# EAGLE schematic ferminator2000 (EAGLE 6.2)

## Sheet 1 of 4
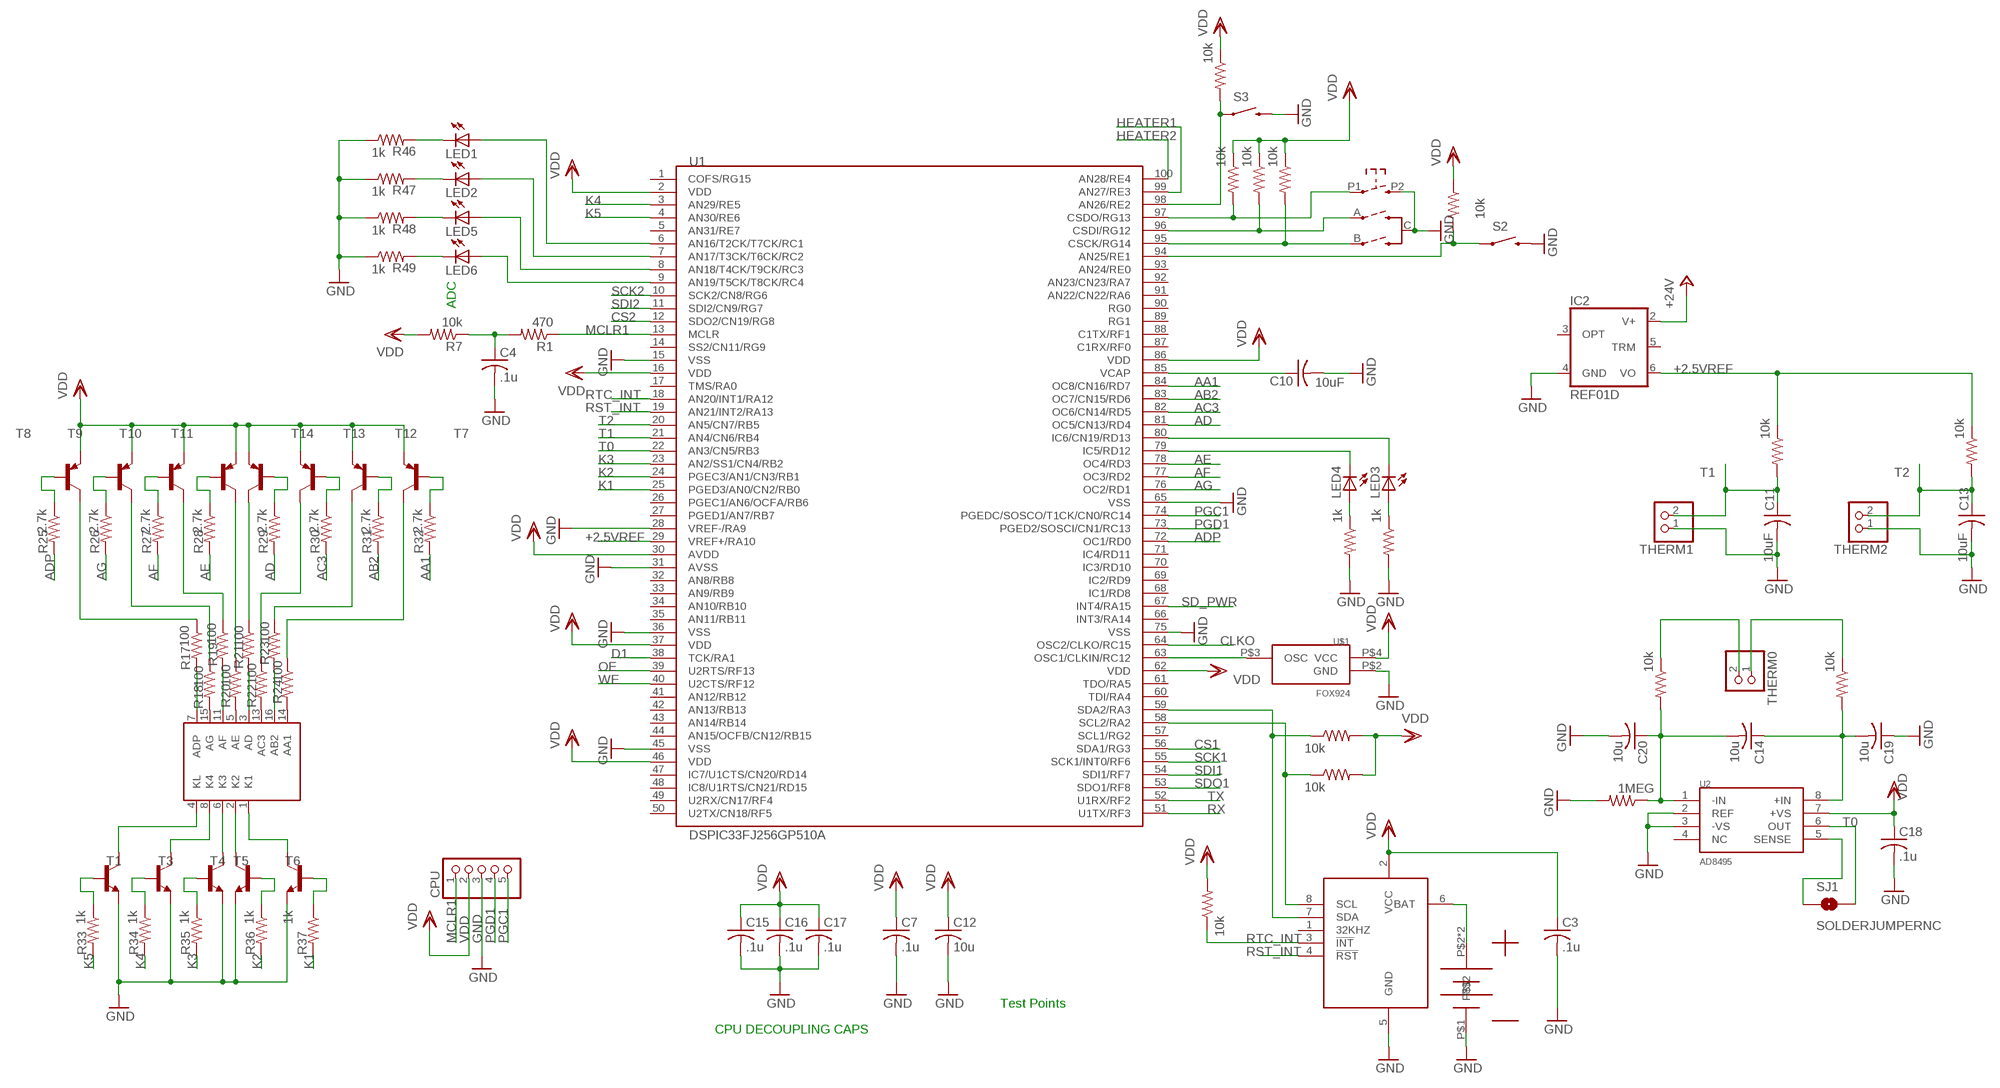
[diagram p0: schematic, sheet 1]

### Parts
C3  .1u  C-USC0603  [C0603]
C4  .1u  C-USC0603  [C0603]
C7  .1u  C-USC0603  [C0603]
C10  10uF  C-USC0805  [C0805]
C11  10uF  C-USC0805  [C0805]
C12  10u  C-USC0805  [C0805]
C13  10uF  C-USC0805  [C0805]
C14  10u  C-USC0603  [C0603]
C15  .1u  C-USC0603  [C0603]
C16  .1u  C-USC0603  [C0603]
C17  .1u  C-USC0603  [C0603]
C18  .1u  C-USC0603  [C0603]
C19  10u  C-USC0603  [C0603]
C20  10u  C-USC0603  [C0603]
CPU  PINHD-1X5  [1X05]
IC2  REF01D  [SO08]
LED1  LEDCHIP-LED0805  [CHIP-LED0805]
LED2  LEDCHIP-LED0805  [CHIP-LED0805]
LED3  LEDCHIP-LED0805  [CHIP-LED0805]
LED4  LEDCHIP-LED0805  [CHIP-LED0805]
LED5  LEDCHIP-LED0805  [CHIP-LED0805]
LED6  LEDCHIP-LED0805  [CHIP-LED0805]
R1  470  R-US_R0805  [R0805]
R7  10k  R-US_R0805  [R0805]
R14  1k  R-US_R0805  [R0805]
R15  1k  R-US_R0805  [R0805]
R17  100  R-US_R0805  [R0805]
R18  100  R-US_R0805  [R0805]
R19  100  R-US_R0805  [R0805]
R20  100  R-US_R0805  [R0805]
R21  100  R-US_R0805  [R0805]
R22  100  R-US_R0805  [R0805]
R23  100  R-US_R0805  [R0805]
R24  100  R-US_R0805  [R0805]
R25  2.7k  R-US_R0805  [R0805]
R26  2.7k  R-US_R0805  [R0805]
R27  2.7k  R-US_R0805  [R0805]
R28  2.7k  R-US_R0805  [R0805]
R29  2.7k  R-US_R0805  [R0805]
R30  2.7k  R-US_R0805  [R0805]
R31  2.7k  R-US_R0805  [R0805]
R32  2.7k  R-US_R0805  [R0805]
R33  1k  R-US_R0805  [R0805]
R34  1k  R-US_R0805  [R0805]
R35  1k  R-US_R0805  [R0805]
R36  1k  R-US_R0805  [R0805]
R37  1k  R-US_R0805  [R0805]
R38  10k  R-US_R0805  [R0805]
R39  10k  R-US_R0805  [R0805]
R40  1MEG  R-US_R0805  [R0805]
R41  10k  R-US_R0805  [R0805]
R42  10k  R-US_R0805  [R0805]
R43  10k  R-US_R0805  [R0805]
R44  10k  R-US_R0805  [R0805]
R45  10k  R-US_R0805  [R0805]
R46  1k  R-US_R0805  [R0805]
R47  1k  R-US_R0805  [R0805]
R48  1k  R-US_R0805  [R0805]
R49  1k  R-US_R0805  [R0805]
R50  10k  R-US_R0805  [R0805]
R51  10k  R-US_R0805  [R0805]
R52  10k  R-US_R0805  [R0805]
R53  10k  R-US_R0805  [R0805]
R54  10k  R-US_R0805  [R0805]
S2  SWITCH-MOMENTARY-2  [TACTILE_SWITCH_TALL]
S3  SWITCH-MOMENTARY-2  [TACTILE_SWITCH_TALL]
SJ1  SOLDERJUMPERNC  [SJ_2S]
SW1  ENCODER_SW1-PEC12  [PEC12_INCREMENTAL_ENCODER]
T1  MMBT3904LT1-NPN-SOT23-BEC  [SOT23-BEC]
T3  MMBT3904LT1-NPN-SOT23-BEC  [SOT23-BEC]
T4  MMBT3904LT1-NPN-SOT23-BEC  [SOT23-BEC]
T5  MMBT3904LT1-NPN-SOT23-BEC  [SOT23-BEC]
T6  MMBT3904LT1-NPN-SOT23-BEC  [SOT23-BEC]
T7  MMBT3906LT1-PNP-SOT23-BEC  [SOT23-BEC]
T8  MMBT3906LT1-PNP-SOT23-BEC  [SOT23-BEC]
T9  MMBT3906LT1-PNP-SOT23-BEC  [SOT23-BEC]
T10  MMBT3906LT1-PNP-SOT23-BEC  [SOT23-BEC]
T11  MMBT3906LT1-PNP-SOT23-BEC  [SOT23-BEC]
T12  MMBT3906LT1-PNP-SOT23-BEC  [SOT23-BEC]
T13  MMBT3906LT1-PNP-SOT23-BEC  [SOT23-BEC]
T14  MMBT3906LT1-PNP-SOT23-BEC  [SOT23-BEC]
THERM0  PINHD-1X2  [1X02]
THERM1  PINHD-1X2  [1X02]
THERM2  PINHD-1X2  [1X02]
U1  DSPIC33FJ256GP510A  [TQFP100]
U2  AD8495  AD8497  [MSOP8]
U$1  FOX924  [CRYSTAL]
U$2  12MM_BATTER_HOLDER  [12.5MMCOILCELLHOLDER]
U$5  DS3231  [SOIC8]
U$7  LTC-4027JRLTC-4027JR  [LTC-4727JR]

### Nets
1: R17.1 T8.C
2: R18.1 T9.C
3: R19.1 T10.C
4: R20.1 T11.C
5: R21.1 T14.C
6: R22.1 T13.C
7: R23.1 T12.C
8: R24.1 T7.C
+2.5VREF: IC2.6(VO) R38.1 R39.1 U1.29(VREF+/RA10)
+24V: IC2.2(V+) ; also sheet 2,4
AA1: R32.2 U1.84(OC8/CN16/RD7)
AA1_BASE: R32.1 T7.B
AB2: R31.2 U1.83(OC7/CN15/RD6)
AB2_BASE: R31.1 T12.B
AC3: R30.2 U1.82(OC6/CN14/RD5)
AC3_BASE: R30.1 T13.B
AD: R29.2 U1.81(OC5/CN13/RD4)
AD_BASE: R29.1 T14.B
ADP: R25.2 U1.72(OC1/RD0)
ADP_BASE: R25.1 T8.B
AE: R28.2 U1.78(OC4/RD3)
AE_BASE: R28.1 T11.B
AF: R27.2 U1.77(OC3/RD2)
AF_BASE: R27.1 T10.B
AG: R26.2 U1.76(OC2/RD1)
AG_BASE: R26.1 T9.B
CLKIN: U1.63(OSC1/CLKIN/RC12) U$1.P$3(OSC)
CLKO: U1.64(OSC2/CLKO/RC15)
CS1: U1.56(SDA1/RG3) ; also sheet 2
CS2: U1.12(SDO2/CN19/RG8)
D1: U1.38(TCK/RA1)
GND: C3.2 C4.2 C7.2 C10.2 C11.2 C12.2 C13.2 C15.2 C16.2 C17.2 C18.2 C19.1 C20.2 CPU.3 IC2.4(GND) R14.2 R15.2 R40.2 R46.1 R47.1 R48.1 R49.1 S2.B2 S3.B2 SW1.C(ENCODER:C) SW1.P2 T1.E T3.E T4.E T5.E T6.E THERM1.1 THERM2.1 U1.15(VSS) U1.28(VREF-/RA9) U1.31(AVSS) U1.36(VSS) U1.45(VSS) U1.65(VSS) U1.75(VSS) U2.2(REF) U2.3(-VS) U$1.P$2(GND) U$2.P$1 U$5.5(GND) ; also sheet 2,3,4
HEATER1: U1.99(AN27/RE3) ; also sheet 4
HEATER2: U1.100(AN28/RE4) ; also sheet 4
K1: R37.2 U1.25(PGED3/AN0/CN2/RB0)
K2: R36.2 U1.24(PGEC3/AN1/CN3/RB1)
K3: R35.2 U1.23(AN2/SS1/CN4/RB2)
K3_BASE: R35.1 T4.B
K4: R34.2 U1.3(AN29/RE5)
K4_BASE: R34.1 T3.B
K5: R33.2 U1.4(AN30/RE6)
K5_BASE: R33.1 T1.B
MCLR1: CPU.1 R1.1 U1.13(MCLR)
N$3: LED3.A R14.1
N$5: LED4.A R15.1
N$6: C4.1 R1.2 R7.1
N$10: C10.1 U1.85(VCAP)
N$12: LED4.C U1.79(IC5/RD12)
N$15: LED3.C U1.80(IC6/CN19/RD13)
N$19: T1.C U$7.4(KL)
N$22: U$2.P$2 U$2.P$3 U$5.6(BAT)
N$23: R45.1 U1.59(SDA2/RA3) U$5.7(SDA)
N$27: T3.C U$7.8(K4)
N$28: T4.C U$7.6(K3)
N$29: T5.C U$7.2(K2)
N$30: T6.C U$7.1(K1)
N$31: R18.2 U$7.15(AG)
N$32: C14.2 C20.1 R40.1 R41.2 U2.1(-IN)
N$33: C14.1 C19.2 R42.2 U2.8(+IN)
N$34: R41.1 THERM0.2
N$35: R42.1 THERM0.1
N$36: R36.1 T5.B
N$37: R37.1 T6.B
N$38: SJ1.1 U2.5(SENSE)
N$39: R43.2 S3.A2 U1.98(AN26/RE2)
N$40: R20.2 U$7.5(AE)
N$41: R22.2 U$7.13(AC3)
N$42: R24.2 U$7.14(AA1)
N$43: R17.2 U$7.7(ADP)
N$44: R19.2 U$7.11(AF)
N$46: R44.2 S2.A2 U1.94(AN25/RE1)
N$47: R21.2 U$7.3(AD)
N$48: R23.2 U$7.16(AB2)
N$49: LED6.A U1.9(AN19/T5CK/T8CK/RC4)
N$50: LED5.A U1.8(AN18/T4CK/T9CK/RC3)
N$51: LED2.A U1.7(AN17/T3CK/T6CK/RC2)
N$52: LED1.A U1.6(AN16/T2CK/T7CK/RC1)
N$53: LED1.C R46.2
N$54: LED2.C R47.2
N$55: LED5.C R48.2
N$56: LED6.C R49.2
N$57: R52.2 SW1.B(ENCODER:B) U1.95(CSCK/RG14)
N$58: R50.2 SW1.A(ENCODER:A) U1.96(CSDI/RG12)
N$59: R51.2 SW1.P1 U1.97(CSDO/RG13)
N$60: R53.1 U1.58(SCL2/RA2) U$5.8(SCL)
OE: U1.39(U2RTS/RF13)
PGC1: CPU.5 U1.74(PGEDC/SOSCO/T1CK/CN0/RC14)
PGD1: CPU.4 U1.73(PGED2/SOSCI/CN1/RC13)
RST_INT: U1.19(AN21/INT2/RA13) U$5.4(!RST)
RTC_INT: R54.1 U1.18(AN20/INT1/RA12) U$5.3(!INT)
RX: U1.51(U1TX/RF3) ; also sheet 3
SCK1: U1.55(SCK1/INT0/RF6) ; also sheet 2
SCK2: U1.10(SCK2/CN8/RG6)
SD_PWR: U1.67(INT4/RA15) ; also sheet 2
SDI1: U1.54(SDI1/RF7) ; also sheet 2
SDI2: U1.11(SDI2/CN9/RG7)
SDO1: U1.53(SDO1/RF8) ; also sheet 2
T0: SJ1.2 U1.22(AN3/CN5/RB3) U2.6(OUT)
T1: C11.1 R38.2 THERM1.2 U1.21(AN4/CN6/RB4)
T2: C13.1 R39.2 THERM2.2 U1.20(AN5/CN7/RB5)
TX: U1.52(U1RX/RF2) ; also sheet 3
VDD: C3.1 C7.1 C12.1 C15.1 C16.1 C17.1 C18.1 CPU.2 R7.2 R43.1 R44.1 R45.2 R50.1 R51.1 R52.1 R53.2 R54.2 T7.E T8.E T9.E T10.E T11.E T12.E T13.E T14.E U1.2(VDD) U1.16(VDD) U1.30(AVDD) U1.37(VDD) U1.46(VDD) U1.62(VDD) U1.86(VDD) U2.7(+VS) U$1.P$4(VCC) U$5.2(VCC) ; also sheet 2
WE: U1.40(U2CTS/RF12)
Unconnected: IC2.3(OPT) IC2.5(TRM) U1.1(COFS/RG15) U1.5(AN31/RE7) U1.14(SS2/CN11/RG9) U1.17(TMS/RA0) U1.26(PGEC1/AN6/OCFA/RB6) U1.27(PGED1/AN7/RB7) U1.32(AN8/RB8) U1.33(AN9/RB9) U1.34(AN10/RB10) U1.35(AN11/RB11) U1.41(AN12/RB12) U1.42(AN13/RB13) U1.43(AN14/RB14) U1.44(AN15/OCFB/CN12/RB15) U1.47(IC7/U1CTS/CN20/RD14) U1.48(IC8/U1RTS/CN21/RD15) U1.49(U2RX/CN17/RF4) U1.50(U2TX/CN18/RF5) U1.57(SCL1/RG2) U1.60(TDI/RA4) U1.61(TDO/RA5) U1.66(INT3/RA14) U1.68(IC1/RD8) U1.69(IC2/RD9) U1.70(IC3/RD10) U1.71(IC4/RD11) U1.87(C1RX/RF0) U1.88(C1TX/RF1) U1.89(RG1) U1.90(RG0) U1.91(AN22/CN22/RA6) U1.92(AN23/CN23/RA7) U1.93(AN24/RE0) U2.4(NC) U$5.1(32KHZ)

### Notes on the sheet
- ADC
- Test Points
- CPU DECOUPLING CAPS

## Sheet 2 of 4
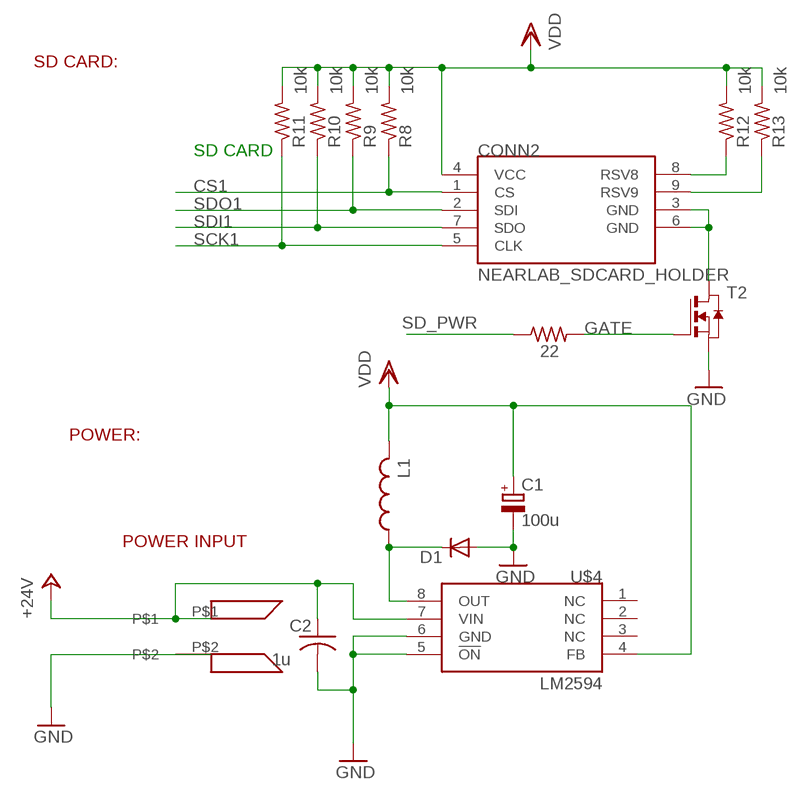
[diagram p1: schematic, sheet 2]

### Parts
C1  100u  CPOL-EUUD-6,3X8,8  [UD-6,3X5,8_NICHICON]
C2  1u  C-USC0805  [C0805]
CONN2  NEARLAB_SDCARD_HOLDER  [NEARLAB_DM1AA-SF-PEJ]
D1  DIODE-SOD323-R  [SOD323-R]
L1  L-USL3225M  [L3225M]
R8  10k  R-US_R0805  [R0805]
R9  10k  R-US_R0805  [R0805]
R10  10k  R-US_R0805  [R0805]
R11  10k  R-US_R0805  [R0805]
R12  10k  R-US_R0805  [R0805]
R13  10k  R-US_R0805  [R0805]
R16  22  R-US_R0805  [R0805]
T2  NMOSSOT23  [SOT-23]
U$3  PHOENIX-3.5MM  [PHOENIX_3.5MM]
U$4  LM2594  [SOIC8]

### Nets
+24V: C2.1 U$3.P$1 U$4.7(VIN) ; also sheet 1,4
CS1: CONN2.1(CS) R8.1 ; also sheet 1
GATE: R16.2 T2.3(G)
GND: C1.- C2.2 D1.A T2.2(S) U$3.P$2 U$4.5(!ON) U$4.6(GND) ; also sheet 1,3,4
N$1: CONN2.9(RSV9) R13.1
N$2: CONN2.8(RSV8) R12.1
N$8: CONN2.3(GND) CONN2.6(GND) T2.1(D)
N$45: D1.C L1.1 U$4.8(OUT)
SCK1: CONN2.5(CLK) R11.1 ; also sheet 1
SD_PWR: R16.1 ; also sheet 1
SDI1: CONN2.7(SDO) R10.1 ; also sheet 1
SDO1: CONN2.2(SDI) R9.1 ; also sheet 1
VDD: C1.+ CONN2.4(VCC) L1.2 R8.2 R9.2 R10.2 R11.2 R12.2 R13.2 U$4.4(FB) ; also sheet 1
Unconnected: U$4.1(NC) U$4.2(NC) U$4.3(NC)

### Notes on the sheet
- SD CARD:
- SD CARD
- POWER:
- POWER INPUT

## Sheet 3 of 4
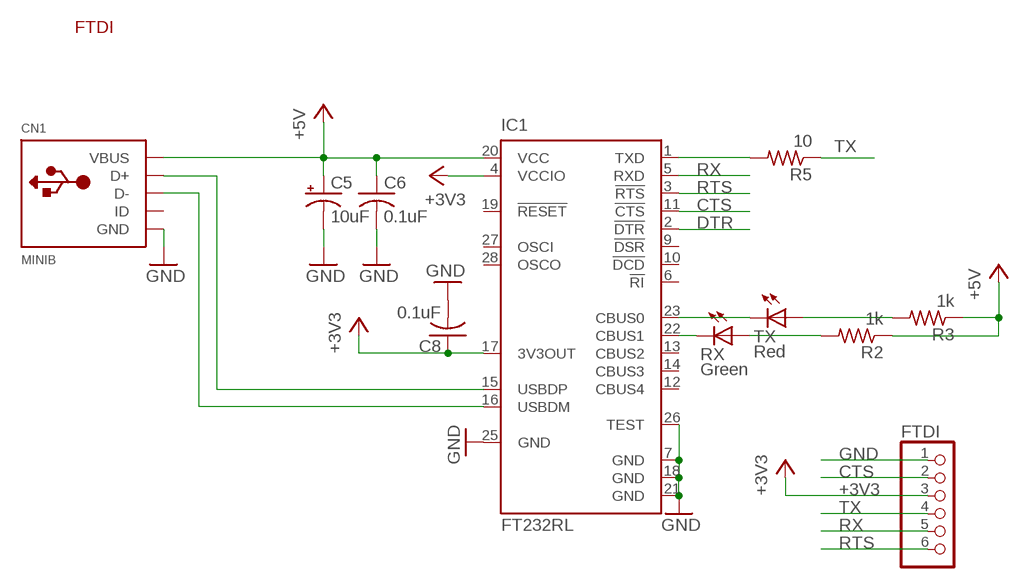
[diagram p2: schematic, sheet 3]

### Parts
C5  10uF  CPOL-USA/3216-18R  [A/3216-18R]
C6  0.1uF  C-USC0805K  [C0805K]
C8  0.1uF  C-USC0805K  [C0805K]
CN1  MINIB  USBMINIB  [USB-MINIB]
FTDI  PINHD-1X6CB  [1X06-CLEANBIG]
IC1  FT232RL  [SSOP28]
R2  1k  R-US_R0805  [R0805]
R3  1k  R-US_R0805  [R0805]
R5  10  R-US_R0805  [R0805]
RX  Green  LEDCHIP-LED0805  [CHIP-LED0805]
TX  Red  LEDCHIP-LED0805  [CHIP-LED0805]

### Nets
+3V3: C8.1 FTDI.3 IC1.4(VCCIO) IC1.17(3V3OUT)
+5V: C5.+ C6.1 CN1.VBUS IC1.20(VCC) R2.1 R3.1
CTS: FTDI.2 IC1.11(!CTS)
DTR: IC1.2(!DTR)
GND: C5.- C6.2 C8.2 CN1.GND FTDI.1 IC1.7(GND) IC1.18(GND) IC1.21(GND) IC1.25(GND) IC1.26(TEST) ; also sheet 1,2,4
N$7: CN1.D+ IC1.15(USBDP)
N$9: CN1.D- IC1.16(USBDM)
N$11: IC1.23(CBUS0) TX.C
N$13: IC1.22(CBUS1) RX.C
N$14: R2.2 RX.A
N$16: R3.2 TX.A
N$17: IC1.1(TXD) R5.2
RTS: FTDI.6 IC1.3(!RTS)
RX: FTDI.5 IC1.5(RXD) ; also sheet 1
TX: FTDI.4 R5.1 ; also sheet 1
Unconnected: CN1.ID IC1.6(!RI) IC1.9(!DSR) IC1.10(!DCD) IC1.12(CBUS4) IC1.13(CBUS2) IC1.14(CBUS3) IC1.19(!RESET) IC1.27(OSCI) IC1.28(OSCO)

### Notes on the sheet
- FTDI

## Sheet 4 of 4
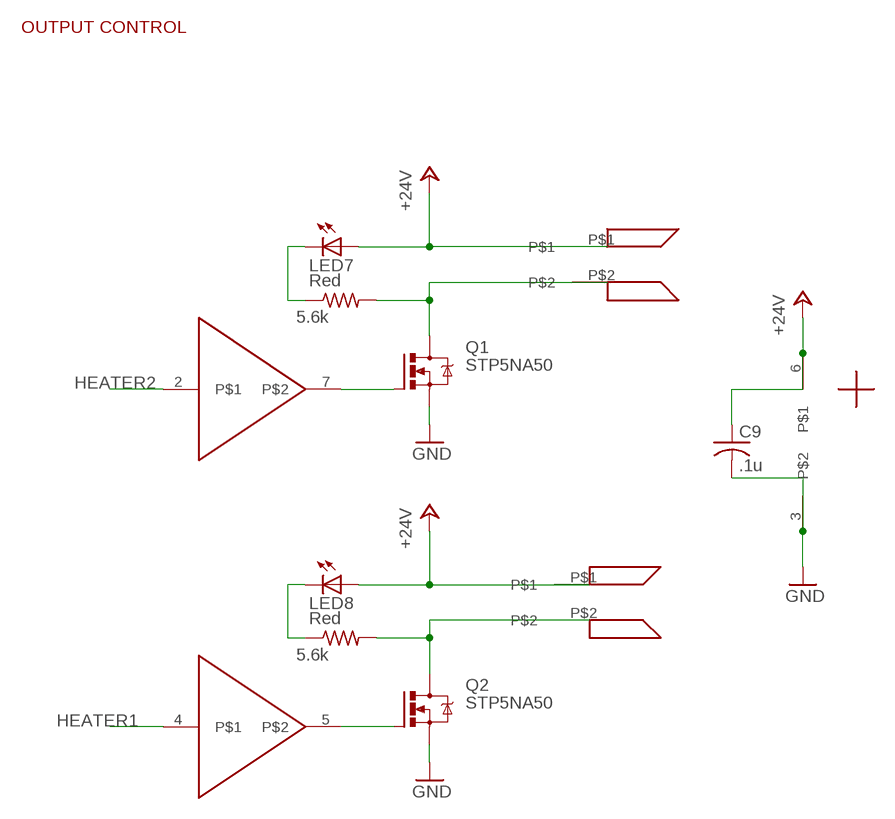
[diagram p3: schematic, sheet 4]

### Parts
C9  .1u  C-USC0603  [C0603]
LED7  Red  LEDCHIP-LED0805  [CHIP-LED0805]
LED8  Red  LEDCHIP-LED0805  [CHIP-LED0805]
Q1  STP5NA50  [TO220BV]
Q2  STP5NA50  [TO220BV]
R4  5.6k  R-US_R0805  [R0805]
R6  5.6k  R-US_R0805  [R0805]
U$8  PHOENIX-3.5MM  [PHOENIX_3.5MM]
U$10  PHOENIX-3.5MM  [PHOENIX_3.5MM]
U$11  TC4427  [SOIC8]

### Nets
+24V: C9.1 LED7.A LED8.A U$8.P$1 U$10.P$1 U$11.6 ; also sheet 1,2
GND: C9.2 Q1.S Q2.S U$11.3 ; also sheet 1,2,3
HEATER1: U$11.4 ; also sheet 1
HEATER2: U$11.2 ; also sheet 1
N$18: Q1.D R4.2 U$10.P$2
N$20: Q1.G U$11.7
N$21: Q2.G U$11.5
N$24: LED7.C R4.1
N$25: Q2.D R6.2 U$8.P$2
N$26: LED8.C R6.1

### Notes on the sheet
- OUTPUT CONTROL

## Library data of the parts
C1 = rcl:CPOL-EU: POLARIZED CAPACITOR, European symbol
C2-C4 C7 C9-C20 = rcl:C-US: CAPACITOR, American symbol
C5 = adafruit:CPOL-US: POLARIZED CAPACITOR, American symbol
C6 C8 = adafruit:C-US: CAPACITOR, American symbol
CN1 = adafruit:USB: USB Connectors USBMINIB - Surface Mount Female Mini-B USB Connector 4UConnector: 06564 By microbuilder.eu Thru-hole RA Female Mini-B USB Connector 4UConnector: 18732 By ladyada.net
CONN2 = main2:NEARLAB_SDCARD_HOLDER
CPU = pinhead:PINHD-1X5: PIN HEADER
D1 = diode:DIODE-: DIODE
FTDI = adafruit:PINHD-1X6: PIN HEADER
IC1 = ftdichip:FT232R: Source: http://www.ftdichip.com/Documents/DataSheets/DS_FT232R_v104.pdf; MPN: FT232RL; OC_FARNELL: 1146032; OC_NEWARK: 91K9918
IC2 = linear:REF01: VOLTAGE REFERENCE
L1 = rcl:L-US: INDUCTOR, American symbol
LED1-LED6 = led:LED: LED
LED7 LED8 RX TX = adafruit:LED: LED
Q1 Q2 = transistor-power:STP5NA50: N-CHANNEL MOS FET
R1 R4 R6-R54 = rcl:R-US_: RESISTOR, American symbol
R2 R3 R5 = adafruit:R-US_: RESISTOR, American symbol
S2 S3 = SparkFun:SWITCH-MOMENTARY-2
SJ1 = SparkFun:SOLDERJUMPER: Solder Jumper Standard SMD solder jumper. Used to automate production. Two varients : Normally Open and Normally Closed are the same, but have different paste layers. NC will have a large amount of paste and should jumper during reflow.
SW1 = dp_devices:ENCODER_SW1: Incremental Encoder with push switch
T1 T3-T6 = transistor-neu-to92:*-NPN-: NPN Transistror
T2 = zetex:NMOSSOT23: MOS FET; OC_FARNELL: unknown; OC_NEWARK: unknown
T7-T14 = transistor-neu-to92:*-PNP-: PNP Transistror
THERM0 THERM1 THERM2 = pinhead:PINHD-1X2: PIN HEADER
U1 = main2:DSPIC33FJ256GP510A
U2 = eric_sorensen:AD8497
U$1 = NEAR:FOX924
U$2 = eric_sorensen:12MM_BATTER_HOLDER
U$3 U$8 U$10 = eric_sorensen:PHOENIX-3.5MM
U$4 = eric_sorensen:LM2594
U$5 = eric_sorensen:DS3231
U$7 = LTC-4727JR:LTC-4027JR
U$11 = custom_esorensen:TC4427